# Altium schematic sheet 按键板.SchDoc
size A4
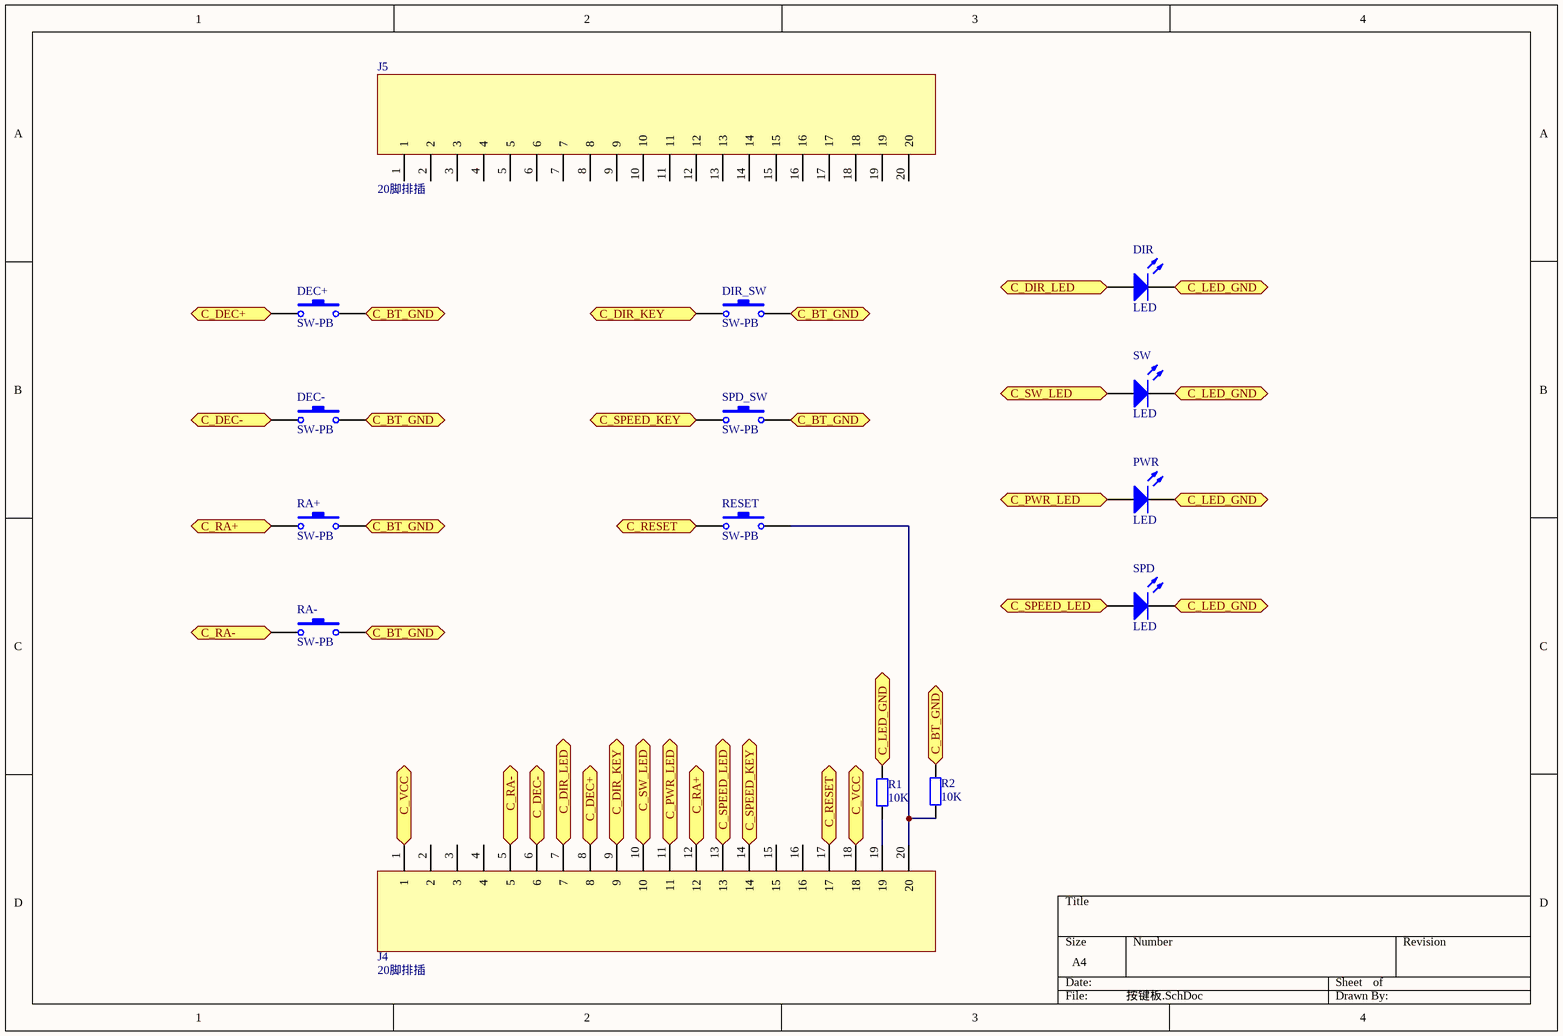
[diagram p0: 按键板.SchDoc]

## Parts
DEC+  SW-PB  [KEY]
DEC-  SW-PB  [KEY]
DIR  LED  [LED]
DIR_SW  SW-PB  [KEY]
J4  20脚排插  [SIP20]
J5  20脚排插  [SIP20]
PWR  LED  [LED]
R1  10K  [resistance]
R2  10K  [resistance]
RA+  SW-PB  [KEY]
RA-  SW-PB  [KEY]
RESET  SW-PB  [KEY]
SPD  LED  [LED]
SPD_SW  SW-PB  [KEY]
SW  LED  [LED]

## Ports
C_BT_GND, C_DEC+, C_DEC-, C_DIR_KEY, C_DIR_LED, C_LED_GND, C_PWR_LED, C_RA+, C_RA-, C_RESET, C_SPEED_KEY, C_SPEED_LED, C_SW_LED, C_VCC

## Nets
C_BT_GND: DEC+.2 DEC-.2 DIR_SW.2 R2.1 RA+.2 RA-.2 SPD_SW.2 ; port C_BT_GND
C_DEC+: DEC+.1 J4.8 ; port C_DEC+
C_DEC-: DEC-.1 J4.6 ; port C_DEC-
C_DIR_KEY: DIR_SW.1 J4.9 ; port C_DIR_KEY
C_DIR_LED: DIR.1(A) J4.7 ; port C_DIR_LED
C_LED_GND: DIR.2(K) PWR.2(K) R1.1 SPD.2(K) SW.2(K) ; port C_LED_GND
C_PWR_LED: J4.11 PWR.1(A) ; port C_PWR_LED
C_RA+: J4.12 RA+.1 ; port C_RA+
C_RA-: J4.5 RA-.1 ; port C_RA-
C_RESET: J4.17 RESET.1 ; port C_RESET
C_SPEED_KEY: J4.14 SPD_SW.1 ; port C_SPEED_KEY
C_SPEED_LED: J4.13 SPD.1(A) ; port C_SPEED_LED
C_SW_LED: J4.10 SW.1(A) ; port C_SW_LED
C_VCC: J4.1 J4.18 ; port C_VCC
NetJ4_19: J4.19 R1.2
NetJ4_20: J4.20 R2.2 RESET.2

Not connected (* = marked no-connect by the designer): J4 2 3 4 15 16; J5 1 2 3 4 5 6 7 8 9 10 11 12 13 14 15 16 17 18 19 20

## Library data of the parts
DEC+ DEC- DIR_SW RA+ RA- RESET SPD_SW = SW-PB: Switch; Published: 24-Mar-1999; LatestRevisionDate: 17-Jul-2002; LatestRevisionNote: Re-released for DXP Platform.; PackageReference: SPST-2; Publisher: Altium Limited; PackageDescription: Switch; 2 Leads
DIR PWR SPD SW = LED: Typical INFRARED GaAs LED; Published: 8-Jun-2000; LatestRevisionDate: 08-Jul-2005; LatestRevisionNote: Mech Layer 1 removed.; PackageReference: LED-0; Publisher: Altium Limited; PackageDescription: LED; 2 Leads
R1 R2 = 10K: Resistor; Published: 8-Jun-2000; LatestRevisionDate: 17-Jul-2002; LatestRevisionNote: Re-released for DXP Platform.; PackageReference: AXIAL-0.4; Publisher: Altium Limited; PackageDescription: Axial Device, Thru-Hole; 2 Leads; 0.4 in Pin Spacing